# Altium schematic sheet esp32-s3_connect_lcd.SchDoc
size A4
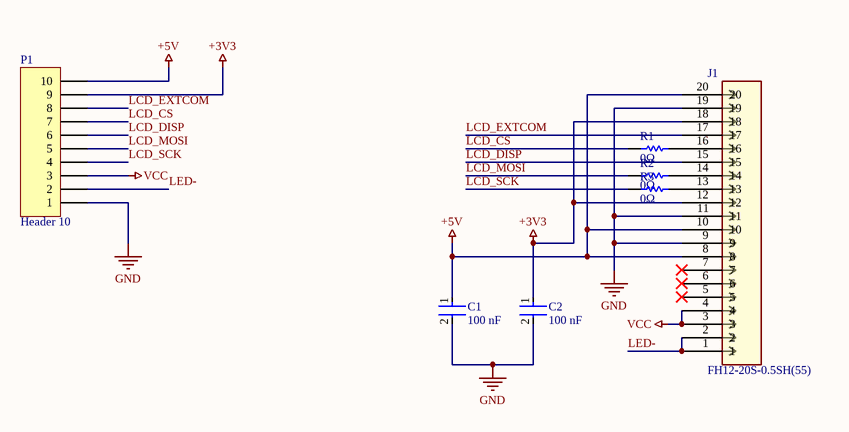
[diagram p0: esp32-s3_connect_lcd.SchDoc]

## Parts
C1  100 nF  [FP-CC0603-DA-MFG]
C2  100 nF  [FP-CC0603-DA-MFG]
J1  FH12-20S-0.5SH(55)  [CONN20_FH12-20S_HIR]
P1  Header 10  [HDR1X10]
R1  0Ω  [RESC2013X50X30LL20T20]
R2  0Ω  [RESC2013X50X30LL20T20]
R3  0Ω  [RESC2013X50X30LL20T20]

## Nets
+3V3: C2.1 J1.12 J1.18 P1.9
+5V: C1.1 J1.8 J1.10 J1.20 P1.10
GND: C1.2 C2.2 J1.9 J1.11 J1.19 P1.1
VCC: J1.3 J1.4 P1.3
LCD_CS: P1.7 R1.1
LCD_DISP: J1.15 P1.6
LCD_EXTCOM: J1.17 P1.8
LCD_MOSI: P1.5 R2.1
LCD_SCK: P1.4 R3.1
LED-: J1.1 J1.2 P1.2
NetJ1_13: J1.13 R3.2
NetJ1_14: J1.14 R2.2
NetJ1_16: J1.16 R1.2

Not connected (* = marked no-connect by the designer): J1 5* 6* 7*

## Library data of the parts
C1 C2 = CMP-2100-03601-2: 50V 100nF X7R ±10% 0603 Multilayer Ceramic Capacitors MLCC - SMD/SMT ROHS; Manufacturer: YAGEO; Mfr. Part #: CC0603KRX7R9BB104; ComponentLink2Description: Datasheet; ComponentLink2URL: http://www.yageo.com/documents/recent/UPY-GPHC_X7R_6.3V-to-50V_18.pdf; Package: 0603; Value: 100 nF; Datasheet: https://datasheet.lcsc.com/lcsc/2211101700_YAGEO-CC0603KRX7R9BB104_C14663.pdf; LCSC Part #: C14663
J1 = FH12-20S-0.5SH55: -40℃~+85℃ Clamshell 20P Bottom Contact Surface Mount，Right Angle 0.5mm SMD,P=0.5mm,Surface Mount，Right Angle FFC/FPC Connectors ROHS; Manufacturer: HRS(Hirose); Package: SMD,P=0.5mm,Surface Mount，Right Angle; Datasheet: https://datasheet.lcsc.com/lcsc/2102241735_HRS-Hirose-FH12-20S-0-5SH-55_C596730.pdf; Mfr. Part #: FH12-20S-0.5SH(55); LCSC Part #: C596730
P1 = Header 10: Header, 10-Pin; LatestRevisionDate: 17-Jul-2002; LatestRevisionNote: Re-released for DXP Platform.; Publisher: Altium Limited
R1-R3 = CMP-2001-04896-1: 125mW Thick Film Resistors 200V 0Ω 0805 Chip Resistor - Surface Mount ROHS; Mfr. Part #: CRCW08050000Z0EA; Manufacturer: Vishay Intertech; Datasheet: Vishay Dale; Value: 0Ω; Package: 0805; LCSC Part #: C844934